# EasyEDA schematic Multitouch_alaMTK.json
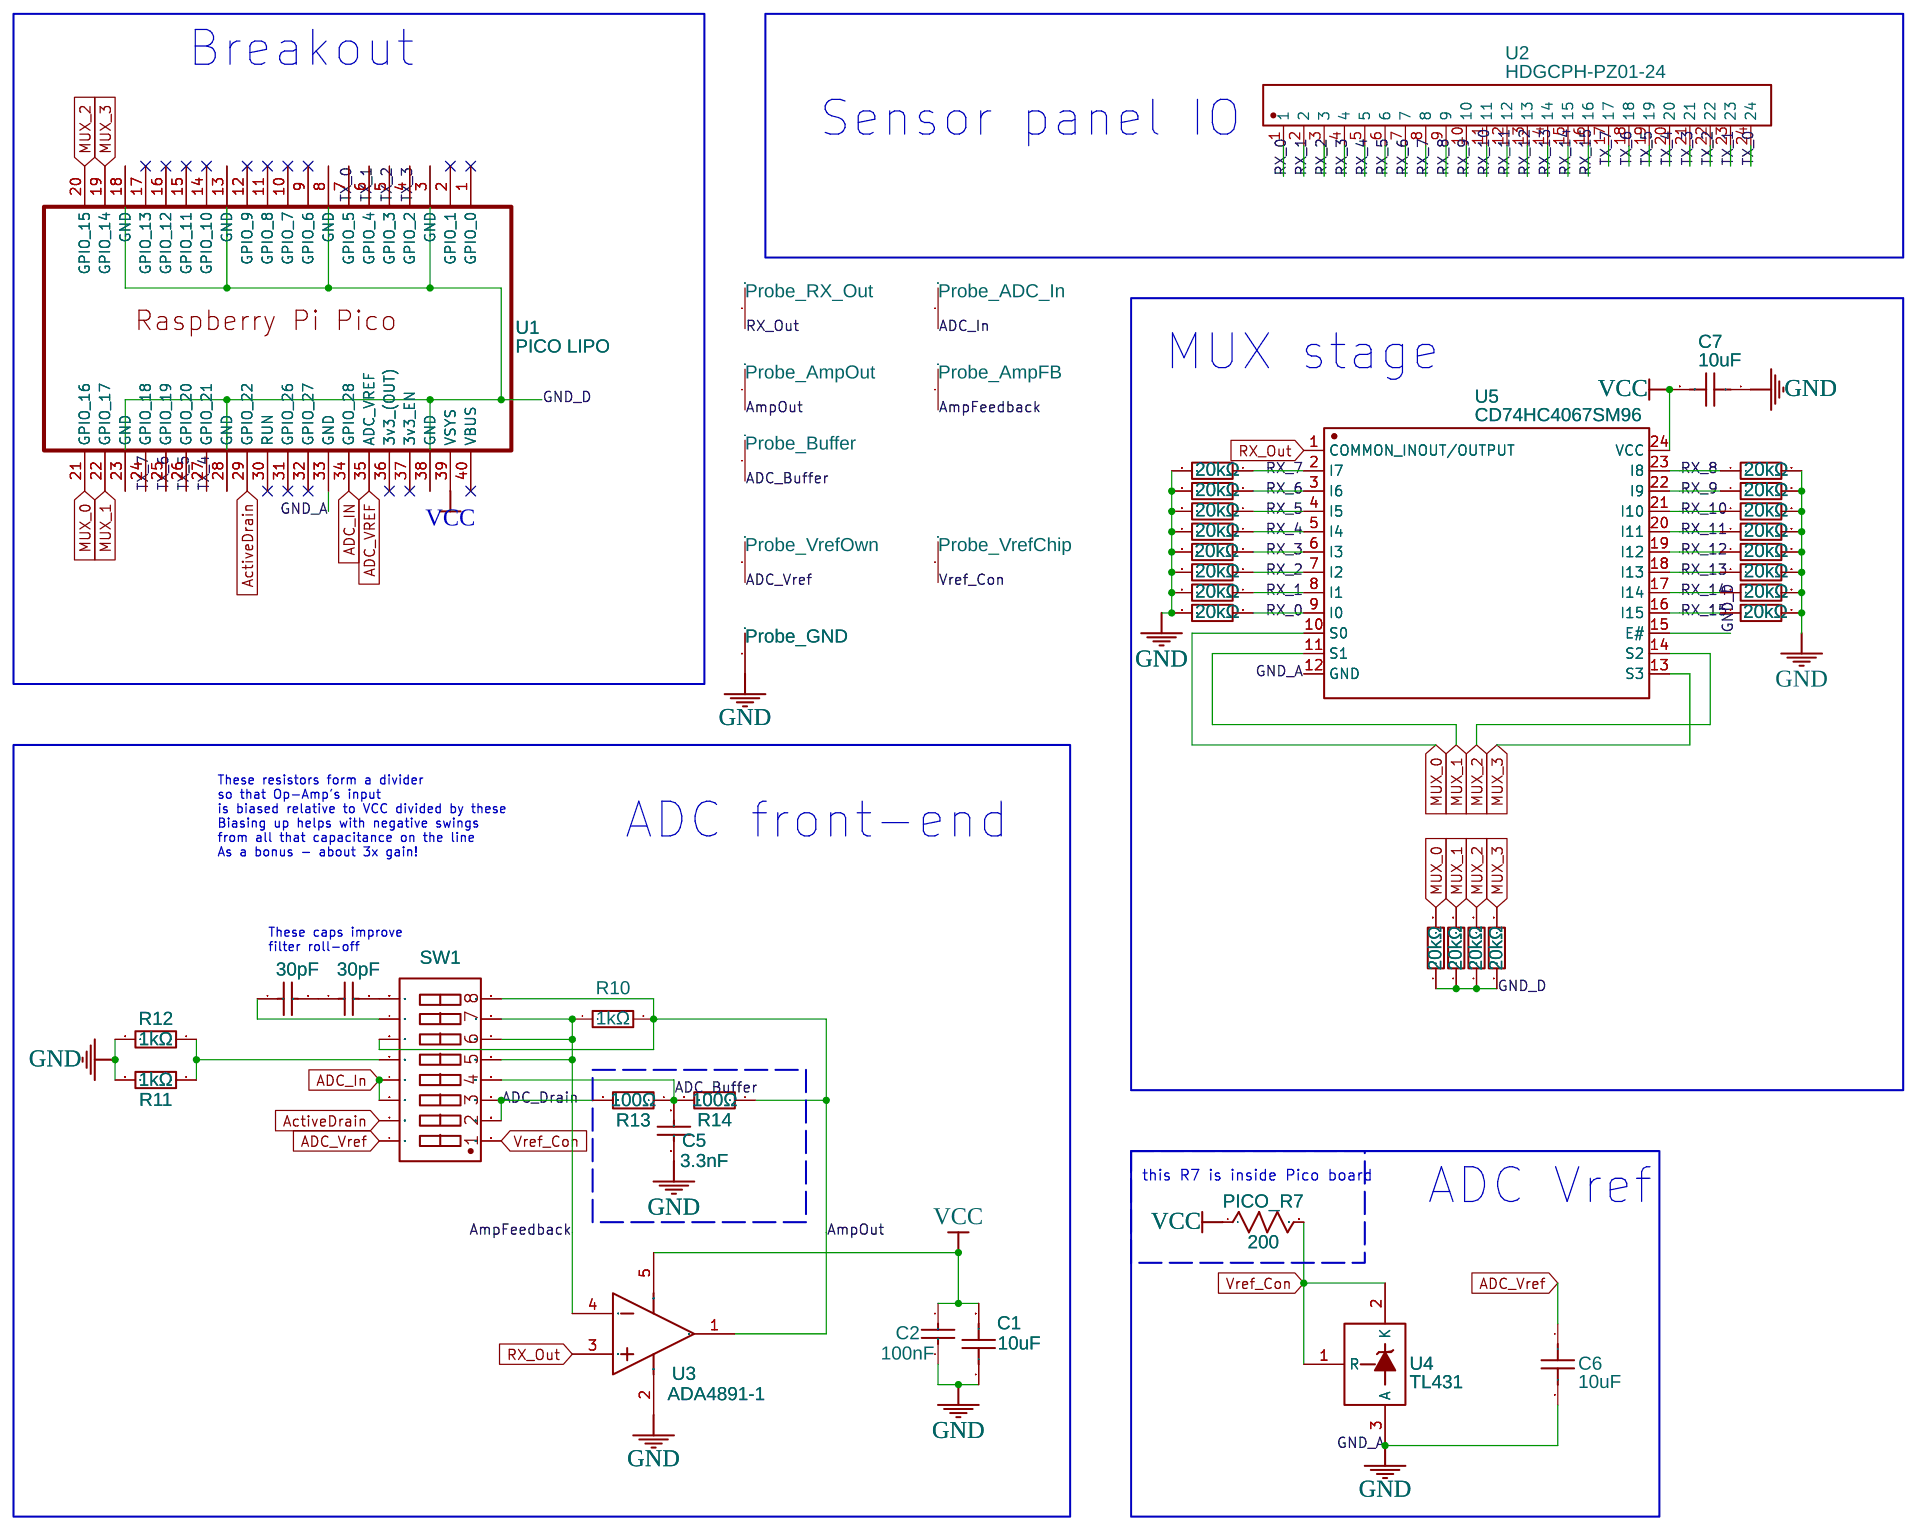
[diagram p0: schematic sheet]

## Parts
ADCB  Probe_Buffer  [SINGLE_PIN_FOOTPRINT]
ADCI  Probe_ADC_In  [SINGLE_PIN_FOOTPRINT]
ADCV  Probe_VrefOwn  [SINGLE_PIN_FOOTPRINT]
AFB  Probe_AmpFB  [SINGLE_PIN_FOOTPRINT]
AO  Probe_AmpOut  [SINGLE_PIN_FOOTPRINT]
C1  10uF  [C0603]
C2  100nF  [C0402]
C3  30pF  [C0603]
C4  30pF  [C0603]
C5  3.3nF  [C0603]
C6  10uF  [C0603]
C7  10uF  [C0603]
J2  Probe_GND  [SINGLE_PIN_FOOTPRINT]
PICO_R7  200  [R0603]
R10  1kΩ  [R0402]
R11  1kΩ  [R0402]
R12  1kΩ  [R0402]
R13  100Ω  [R0402]
R14  100Ω  [R0402]
R15  20kΩ  [R0402]
R16  20kΩ  [R0402]
R17  20kΩ  [R0402]
R18  20kΩ  [R0402]
R19  20kΩ  [R0402]
R20  20kΩ  [R0402]
R21  20kΩ  [R0402]
R22  20kΩ  [R0402]
R23  20kΩ  [R0402]
R24  20kΩ  [R0402]
R25  20kΩ  [R0402]
R26  20kΩ  [R0402]
R27  20kΩ  [R0402]
R28  20kΩ  [R0402]
R29  20kΩ  [R0402]
R30  20kΩ  [R0402]
R31  20kΩ  [R0402]
R32  20kΩ  [R0402]
R33  20kΩ  [R0402]
R34  20kΩ  [R0402]
RXO  Probe_RX_Out  [SINGLE_PIN_FOOTPRINT]
SW1  KF1027B-08P-L00-DFT-01B  [SW-SMD_16P-L21.3-W6.2-P1.27-LS9.9-BL]
U1  PICO LIPO  [RASPBERRY PI PICO/ RASPBERRY PI PICO W]
U2  HDGCPH-PZ01-24  [HDR-TH_24P-P2.54-V-M_1]
U3  ADA4891-1  [SOT-23-5_L3.0-W1.7-P0.95-LS2.8-BR]
U4  TL431  [SOT-23-3_L2.9-W1.6-P1.90-LS2.8-BR]
U5  CD74HC4067SM96  [SSOP-24_L8.1-W5.3-P0.65-LS7.8-BL]
VREF  Probe_VrefChip  [SINGLE_PIN_FOOTPRINT]

## Library data of the parts
ADCB ADCI ADCV AFB AO J2 RXO VREF = SINGLE_PIN: Contributor: Sam Gilligan
C1 C6 C7 = CL10A106KP8NNNC: Supplier: LCSC; Manufacturer: SAMSUNG(三星); Supplier Part: C19702; JLCPCB Part Class: Basic Part
C2 = CL05B104KO5NNNC: Supplier: LCSC; Manufacturer: SAMSUNG(三星); Supplier Part: C1525; JLCPCB Part Class: Basic Part
C3 C4 = 0603CG300J500NT: Supplier: LCSC; Manufacturer: FH(风华); Supplier Part: C1658; JLCPCB Part Class: Basic Part
C5 = CL10B332KB8NNNC: Supplier: LCSC; Manufacturer: SAMSUNG(三星); Supplier Part: C1613; JLCPCB Part Class: Basic Part
PICO_R7 = R_0603_US: Contributor: LCEDA_Lib
R10-R12 = 0402WGF1001TCE: Supplier: LCSC; Manufacturer: UNI-ROYAL(厚声); Supplier Part: C11702; JLCPCB Part Class: Basic Part
R13 R14 = 0402WGF1000TCE: Supplier: LCSC; Manufacturer: UNI-ROYAL(厚声); Supplier Part: C25076; JLCPCB Part Class: Basic Part
R15-R34 = 0402WGF2002TCE: Supplier: LCSC; Manufacturer: UNI-ROYAL(厚声); Supplier Part: C25765; JLCPCB Part Class: Basic Part
SW1 = KF1027B-08P-L00-DFT-01B: Contributor: lcsc; Supplier: LCSC; Supplier Part: C976359; Manufacturer: 凯峰; JLCPCB Part Class: Extended Part
U1 = RASPBERRY PI PICO WITH 3D MODEL COPY: Contributor: sunilgoud410
U2 = HDGCPH-PZ01-24: Supplier: LCSC; Supplier Part: C19190990; Manufacturer: HDGC(华德共创); Contributor: lcsc; JLCPCB Part Class: Extended Part
U3 = ADA4891-1ARJZ-R7: Contributor: LCSC; Supplier: LCSC; Manufacturer: ADI(亚德诺); Supplier Part: C141926; JLCPCB Part Class: Extended Part
U4 = CJ431_C3113: Supplier: LCSC; Manufacturer: CJ(江苏长电/长晶); Manufacturer Part: CJ431; Supplier Part: C3113; JLCPCB Part Class: Basic Part
U5 = CD74HC4067SM96: Supplier: LCSC; Manufacturer: TI(德州仪器); Supplier Part: C98457; JLCPCB Part Class: Extended Part

## Nets
GND: C1.1 C2.1 C5.1 C6.2 C7.1 J2.1 R11.2 R12.2 R19.2 R20.2 R21.2 R22.2 R23.2 R24.2 R25.2 R26.2 R27.2 R28.2 R29.2 R30.2 R31.2 R32.2 R33.2 R34.2 U1.33(GND) U3.2(-VS) U4.3(A) U5.12(GND)
GND_D: R15.1 R16.1 R17.1 R18.1 U1.3(GND) U1.8(GND) U1.13(GND) U1.18(GND) U1.23(GND) U1.28(GND) U1.38(GND) U5.15(E#)
VCC: C1.2 C2.2 C7.2 PICO_R7.1 U1.39(VSYS) U3.5(+VS) U5.24(VCC)
ActiveDrain: SW1.2(PIN2) U1.29(GPIO 22)
ADC_Buffer: ADCB.1 C5.2 R13.1 R14.2 SW1.12(PIN12)
ADC_Drain: R13.2 SW1.10(PIN10) SW1.11(PIN11)
ADC_IN: U1.34(GPIO 28)
ADC_In: ADCI.1 SW1.3(PIN3) SW1.4(PIN4)
ADC_VREF: U1.35(ADC_VREF)
ADC_Vref: ADCV.1 C6.1 SW1.1(PIN1)
AmpFeedback: AFB.1 R10.1 SW1.13(PIN13) SW1.14(PIN14) SW1.15 U3.4(-IN)
AmpOut: AO.1 R10.2 R14.1 SW1.6(PIN6) SW1.16 U3.1(OUT)
MUX_0: R18.2 U1.21(GPIO 16) U5.10(S0)
MUX_1: R17.2 U1.22(GPIO 17) U5.11(S1)
MUX_2: R16.2 U1.20(GPIO 15) U5.14(S2)
MUX_3: R15.2 U1.19(GPIO 14) U5.13(S3)
RX_0: R27.1 U2.1 U5.9(I0)
RX_1: R26.1 U2.2 U5.8(I1)
RX_2: R25.1 U2.3 U5.7(I2)
RX_3: R24.1 U2.4 U5.6(I3)
RX_4: R23.1 U2.5 U5.5(I4)
RX_5: R22.1 U2.6 U5.4(I5)
RX_6: R21.1 U2.7 U5.3(I6)
RX_7: R20.1 U2.8 U5.2(I7)
RX_8: R19.1 U2.9 U5.23(I8)
RX_9: R28.1 U2.10 U5.22(I9)
RX_10: R29.1 U2.11 U5.21(I10)
RX_11: R30.1 U2.12 U5.20(I11)
RX_12: R31.1 U2.13 U5.19(I12)
RX_13: R32.1 U2.14 U5.18(I13)
RX_14: R33.1 U2.15 U5.17(I14)
RX_15: R34.1 U2.16 U5.16(I15)
RX_Out: RXO.1 U3.3(+IN) U5.1(COMMON INOUT/OUTPUT)
TX_0: U1.7(GPIO 5) U2.24
TX_1: U1.6(GPIO 4) U2.23
TX_2: U1.5(GPIO 3) U2.22
TX_3: U1.4(GPIO 2) U2.21
TX_4: U1.27(GPIO 21) U2.20
TX_5: U1.26(GPIO 20) U2.19
TX_6: U1.25(GPIO 19) U2.18
TX_7: U1.24(GPIO 18) U2.17
Vref_Con: PICO_R7.2 SW1.9(PIN9) U4.1(R) U4.2(K) VREF.1
Net-(C3-1): C3.1 C4.2
Net-(C3-2): C3.2 SW1.8(PIN8)
Net-(C4-1): C4.1 SW1.7(PIN7)
Net-(R11-1): R11.1 R12.1 SW1.5(PIN5)

Not connected (* = marked no-connect by the designer): U1 1(GPIO 0)* 2(GPIO 1)* 9(GPIO 6)* 10(GPIO 7)* 11(GPIO 8)* 12(GPIO 9)* 14(GPIO 10)* 15(GPIO 11)* 16(GPIO 12)* 17(GPIO 13)* 30(RUN)* 31(GPIO 26)* 32(GPIO 27)* 36(3v3 (OUT))* 37(3v3_EN)* 40(VBUS)*

## Notes on the sheet
- Breakout
- Sensor panel IO
- MUX stage
- These resistors form a divider
  so that Op-Amp's input
  is biased relative to VCC divided by these
  Biasing up helps with negative swings
  from all that capacitance on the line
  As a bonus - about 3x gain!
- ADC front-end
- These caps improve
  filter roll-off
- this R7 is inside Pico board
- ADC Vref
